# Altium schematic sheet connector.SchDoc
size A4; SheetNumber: 2; SheetTotal: 2
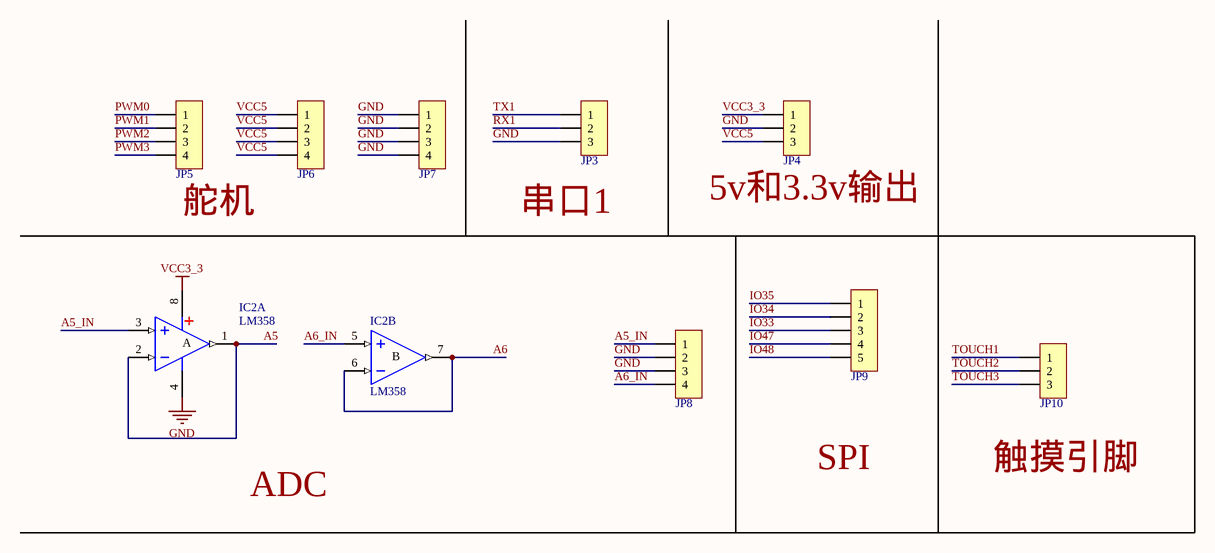
[diagram p0: connector.SchDoc]

## Parts
IC2  LM358  [SOP8_N]  (parts A,B of 2)
JP3  HDR-1X3  [HDR2.54-LI-3P]  (value not drawn)
JP4  HDR-1X3  [HDR2.54-LI-3P]  (value not drawn)
JP5  HDR-1X4  [HDR2.54-LI-4P]  (value not drawn)
JP6  HDR-1X4  [HDR2.54-LI-4P]  (value not drawn)
JP7  HDR-1X4  [HDR2.54-LI-4P]  (value not drawn)
JP8  HDR-1X4  [HDR2.54-LI-4P]  (value not drawn)
JP9  HDR-1X5  [HDR2.54-LI-5P]  (value not drawn)
JP10  HDR-1X3  [HDR2.54-LI-3P]  (value not drawn)

## Nets
GND: IC2.4(V-) JP3.3 JP4.2 JP7.1 JP7.2 JP7.3 JP7.4 JP8.2 JP8.3
VCC3_3: IC2.8(V+) JP4.1
A5: IC2.1(OUT) IC2.2(IN-)
A5_IN: IC2.3(IN+) JP8.1
A6: IC2.6(IN-) IC2.7(OUT)
A6_IN: IC2.5(IN+) JP8.4
IO33: JP9.3
IO34: JP9.2
IO35: JP9.1
IO47: JP9.4
IO48: JP9.5
PWM0: JP5.1
PWM1: JP5.2
PWM2: JP5.3
PWM3: JP5.4
RX1: JP3.2
TOUCH1: JP10.1
TOUCH2: JP10.2
TOUCH3: JP10.3
TX1: JP3.1
VCC5: JP4.3 JP6.1 JP6.2 JP6.3 JP6.4

## Notes on the sheet
- (near JP5) 舵机
- (near JP3) 串口1
- (near JP4) 5v和3.3v输出
- ADC
- SPI
- 触摸引脚
- (in symbol LM358, part A) A
- (in symbol LM358, part B) B

## Library data of the parts
IC2 = LM358: 双路运放; 封装库来自淘宝卖家：黄晶宝石: 其他店铺购入均为赃物，无售后更新权益，请立即申请退款，退款后现金奖励200~1000元; BOM名称: 双路运放
JP3 JP4 JP10 = Header 3: 3P接插件; 联系卖家，免费查找封装: 唯一出售店铺网址https://shop463601444.taobao.com; 封装库来自淘宝卖家ID：黄晶宝石: 其他店铺购入均为盗版封装库，请立即申请退款，本店现金奖励50~200元; BOM名称: 3P接插件
JP5-JP8 = Header 4: 4P接插件; 联系卖家，免费查找封装: 唯一出售店铺网址https://shop463601444.taobao.com; 封装库来自淘宝卖家ID：黄晶宝石: 其他店铺购入均为盗版封装库，请立即申请退款，本店现金奖励50~200元; BOM名称: 4P接插件
JP9 = Header 5: 5P接插件; 联系卖家，免费查找封装: 唯一出售店铺网址https://shop463601444.taobao.com; 封装库来自淘宝卖家ID：黄晶宝石: 其他店铺购入均为盗版封装库，请立即申请退款，本店现金奖励50~200元; BOM名称: 5P接插件